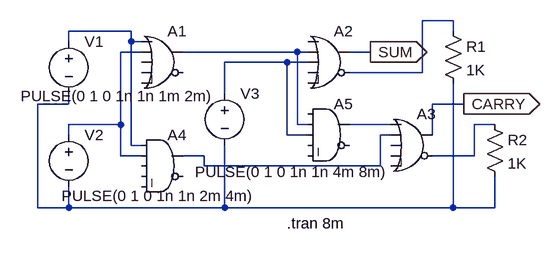
[diagram p0: schematic Full_adder.asc]
Full_adder.asc, the LTspice schematic file:
Version 4
SHEET 1 880 680
WIRE 592 48 544 48
WIRE 96 64 0 64
WIRE 592 64 592 48
WIRE 0 80 0 64
WIRE 96 80 96 64
WIRE 112 80 96 80
WIRE 112 96 80 96
WIRE 352 96 176 96
WIRE 368 96 352 96
WIRE 464 96 432 96
WIRE 336 112 240 112
WIRE 368 112 336 112
WIRE 544 128 544 48
WIRE 544 128 432 128
WIRE 240 160 240 112
WIRE 0 176 0 160
WIRE 0 176 -48 176
WIRE 608 176 560 176
WIRE 80 208 80 96
WIRE 80 208 0 208
WIRE 352 208 352 96
WIRE 368 208 352 208
WIRE 496 208 432 208
WIRE 656 208 624 208
WIRE 0 224 0 208
WIRE 336 224 336 112
WIRE 368 224 336 224
WIRE 496 224 480 224
WIRE 560 224 560 176
WIRE 96 240 96 80
WIRE 112 240 96 240
WIRE 80 256 80 208
WIRE 112 256 80 256
WIRE 208 256 176 256
WIRE 624 256 624 208
WIRE 624 256 560 256
WIRE 208 272 208 256
WIRE 480 272 480 224
WIRE 480 272 208 272
WIRE -48 336 -48 176
WIRE 0 336 0 304
WIRE 0 336 -48 336
WIRE 240 336 240 240
WIRE 240 336 0 336
WIRE 592 336 592 144
WIRE 592 336 240 336
WIRE 656 336 656 288
WIRE 656 336 592 336
FLAG 464 96 SUM
IOPIN 464 96 Out
FLAG 608 176 CARRY
IOPIN 608 176 Out
SYMBOL voltage 0 64 R0
WINDOW 3 -74 100 Left 2
WINDOW 123 0 0 Left 0
WINDOW 39 0 0 Left 0
SYMATTR InstName V1
SYMATTR Value PULSE(0 1 0 1n 1n 1m 2m)
SYMBOL voltage 0 208 R0
WINDOW 3 -11 110 Left 2
WINDOW 123 0 0 Left 0
WINDOW 39 0 0 Left 0
SYMATTR InstName V2
SYMATTR Value PULSE(0 1 0 1n 1n 2m 4m)
SYMBOL voltage 240 144 R0
WINDOW 3 -46 137 Left 2
WINDOW 123 0 0 Left 0
WINDOW 39 0 0 Left 0
SYMATTR InstName V3
SYMATTR Value PULSE(0 1 0 1n 1n 4m 8m)
SYMBOL Digital\\or 144 48 R0
SYMATTR InstName A1
SYMBOL Digital\\or 400 48 R0
SYMATTR InstName A2
SYMBOL Digital\\or 528 176 R0
SYMATTR InstName A3
SYMBOL Digital\\and 144 208 R0
SYMATTR InstName A4
SYMBOL Digital\\and 400 160 R0
SYMATTR InstName A5
SYMBOL res 576 48 R0
SYMATTR InstName R1
SYMATTR Value 1K
SYMBOL res 640 192 R0
SYMATTR InstName R2
SYMATTR Value 1K
TEXT 336 360 Left 2 !.tran 8m

The netlist it stands for:
* Full_adder.asc
V1 N002 N006 PULSE(0 1 0 1n 1n 1m 2m)
V2 N003 N006 PULSE(0 1 0 1n 1n 2m 4m)
V3 N005 N006 PULSE(0 1 0 1n 1n 4m 8m)
A1 N002 N003 0 0 0 0 N004 0 OR
A2 0 N004 N005 0 0 N001 SUM 0 OR
A3 N007 N009 0 0 0 N008 CARRY 0 OR
A4 N002 N003 0 0 0 0 N009 0 AND
A5 0 N004 N005 0 0 0 N007 0 AND
R1 N001 N006 1K
R2 N008 N006 1K
.tran 8m
.backanno
.end